# EAGLE design sensorboard (EAGLE 6.5.0)
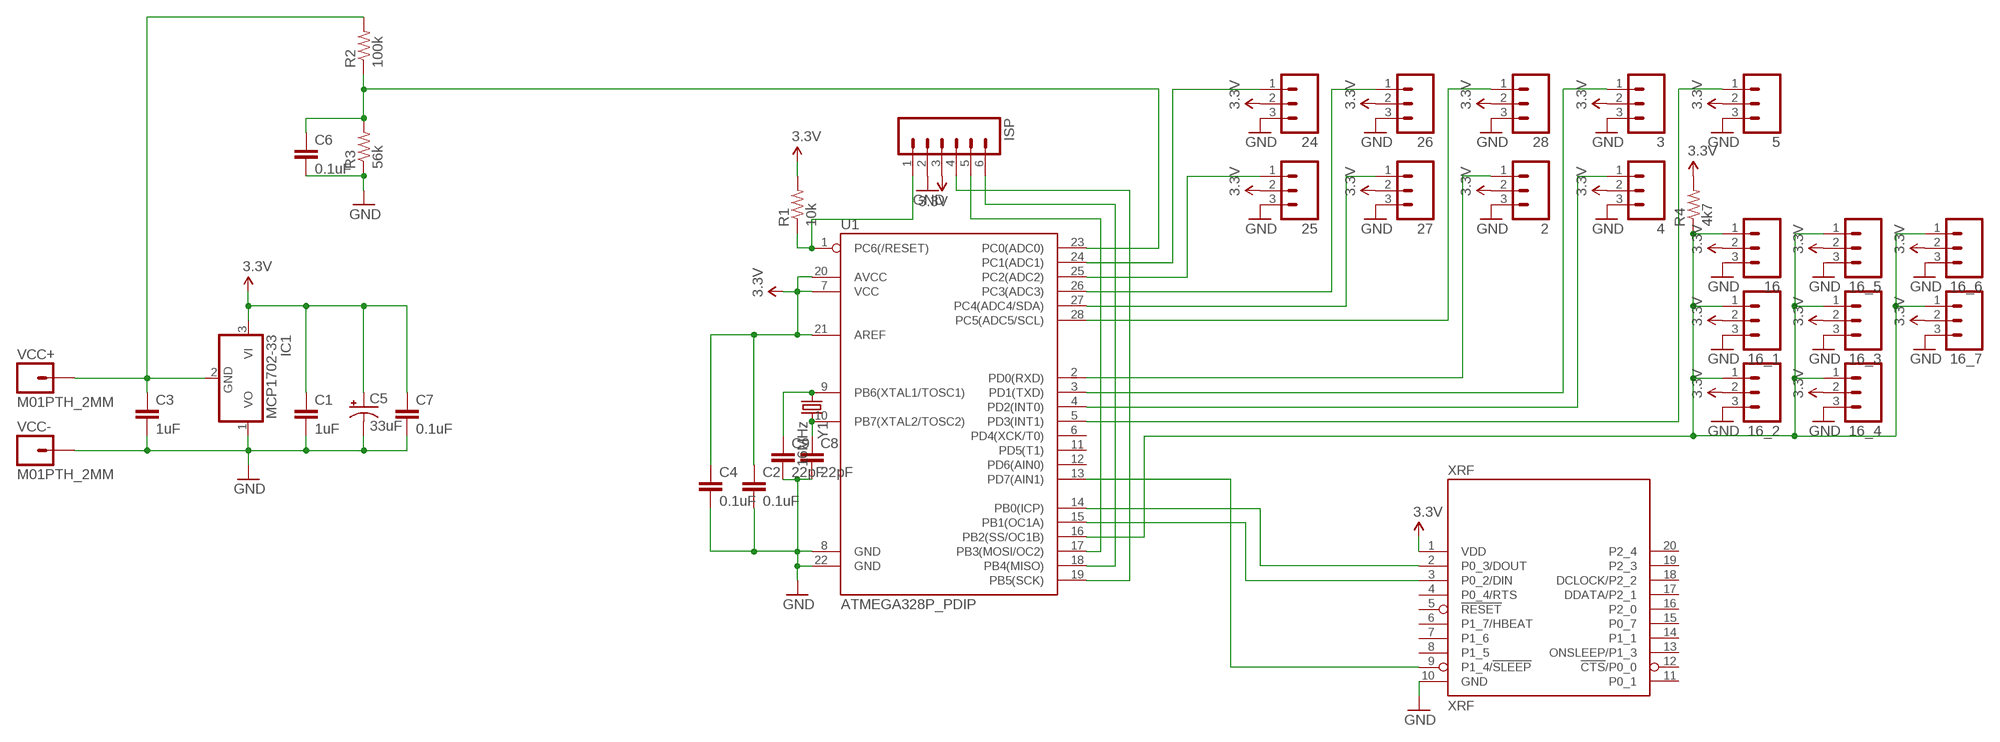
[diagram p0: schematic, sheet 1]

## Parts
2  M031X03_NO_SILK  [1X03_NO_SILK]
3  M031X03_NO_SILK  [1X03_NO_SILK]
4  M031X03_NO_SILK  [1X03_NO_SILK]
5  M031X03_NO_SILK  [1X03_NO_SILK]
16  M031X03_NO_SILK  [1X03_NO_SILK]
16_1  M031X03_NO_SILK  [1X03_NO_SILK]
16_2  M031X03_NO_SILK  [1X03_NO_SILK]
16_3  M031X03_NO_SILK  [1X03_NO_SILK]
16_4  M031X03_NO_SILK  [1X03_NO_SILK]
16_5  M031X03_NO_SILK  [1X03_NO_SILK]
16_6  M031X03_NO_SILK  [1X03_NO_SILK]
16_7  M031X03_NO_SILK  [1X03_NO_SILK]
24  M031X03_NO_SILK  [1X03_NO_SILK]
25  M031X03_NO_SILK  [1X03_NO_SILK]
26  M031X03_NO_SILK  [1X03_NO_SILK]
27  M031X03_NO_SILK  [1X03_NO_SILK]
28  M031X03_NO_SILK  [1X03_NO_SILK]
C1  1uF  CAPEZ  [CAP-PTH-SMALLEZ]
C2  0.1uF  CAPEZ  [CAP-PTH-SMALLEZ]
C3  1uF  CAPEZ  [CAP-PTH-SMALLEZ]
C4  0.1uF  CAPEZ  [CAP-PTH-SMALLEZ]
C5  33uF  CAP_POLPTH2  [CPOL-RADIAL-10UF-25V]
C6  0.1uF  CAPEZ  [CAP-PTH-SMALLEZ]
C7  0.1uF  CAPEZ  [CAP-PTH-SMALLEZ]
C8  22pF  CAPEZ  [CAP-PTH-SMALLEZ]
C9  22pF  CAPEZ  [CAP-PTH-SMALLEZ]
IC1  MCP1702-33  78L05Z  [TO92]
ISP  M06SIP  [1X06]
R1  10k  RESISTOREZ  [AXIAL-0.3EZ]
R2  100k  RESISTOREZ  [AXIAL-0.3EZ]
R3  56k  RESISTOREZ  [AXIAL-0.3EZ]
R4  4k7  RESISTOREZ  [AXIAL-0.3EZ]
U1  ATMEGA328P_PDIP  [DIL28-3]
VCC+  M01PTH_2MM  [1X01_2MM]
VCC-  M01PTH_2MM  [1X01_2MM]
XRF  XRF  XRFXRF  [XRF]
Y1  16MHz  CRYSTALHC49US  [HC49US]

## Nets
3.3V: 2.2 3.2 4.2 5.2 16.2 16_1.2 16_2.2 16_3.2 16_4.2 16_5.2 16_6.2 16_7.2 24.2 25.2 26.2 27.2 28.2 C1.1 C2.1 C4.1 C5.1(+) C7.1 IC1.3(VI) ISP.3 R1.P$2 R4.P$2 U1.7(VCC) U1.20(AVCC) U1.21(AREF) XRF.1(VDD)
GND: 2.3 3.3 4.3 5.3 16.3 16_1.3 16_2.3 16_3.3 16_4.3 16_5.3 16_6.3 16_7.3 24.3 25.3 26.3 27.3 28.3 C1.2 C2.2 C3.2 C4.2 C5.2(-) C6.2 C7.2 C8.2 C9.2 IC1.1(VO) ISP.2 R3.P$1 U1.8(GND) U1.22(GND) VCC-.1 XRF.10(GND)
N$1: ISP.1 R1.P$1 U1.1(PC6(/RESET))
N$2: 28.1 U1.28(PC5(ADC5/SCL))
N$3: ISP.6 U1.18(PB4(MISO))
N$4: ISP.4 U1.19(PB5(SCK))
N$5: ISP.5 U1.17(PB3(MOSI/OC2))
N$6: 2.1 U1.2(PD0(RXD))
N$7: C3.1 IC1.2(GND) R2.P$2 VCC+.1
N$8: 24.1 U1.24(PC1(ADC1))
N$9: U1.15(PB1(OC1A)) XRF.3(P0_2/DIN)
N$10: U1.13(PD7(AIN1)) XRF.9(P1_4/!SLEEP)
N$11: 3.1 U1.3(PD1(TXD))
N$12: 5.1 U1.5(PD3(INT1))
N$13: 4.1 U1.4(PD2(INT0))
N$14: C9.1 U1.9(PB6(XTAL1/TOSC1)) Y1.1
N$15: 16.1 16_1.1 16_2.1 16_3.1 16_4.1 16_5.1 16_6.1 16_7.1 R4.P$1 U1.16(PB2(SS/OC1B))
N$16: C8.1 U1.10(PB7(XTAL2/TOSC2)) Y1.2
N$18: U1.14(PB0(ICP)) XRF.2(P0_3/DOUT)
N$19: 25.1 U1.25(PC2(ADC2))
N$20: C6.1 R2.P$1 R3.P$2 U1.23(PC0(ADC0))
N$21: 26.1 U1.26(PC3(ADC3))
N$22: 27.1 U1.27(PC4(ADC4/SDA))
Unconnected: U1.6(PD4(XCK/T0)) U1.11(PD5(T1)) U1.12(PD6(AIN0)) XRF.4(P0_4/RTS) XRF.5(!RESET) XRF.6(P1_7/HBEAT) XRF.7(P1_6) XRF.8(P1_5) XRF.11(P0_1) XRF.12(!CTS!/P0_0) XRF.13(ONSLEEP/P1_3) XRF.14(P1_1) XRF.15(P0_7) XRF.16(P2_0) XRF.17(DDATA/P2_1) XRF.18(DCLOCK/P2_2) XRF.19(P2_3) XRF.20(P2_4)

## Library data of the parts
2-5 16 16_1-16_7 24-28 = SparkFun-Connectors:M03: Header 3 Standard 3-pin 0.1" header. Use with straight break away headers (SKU : PRT-00116), right angle break away headers (PRT-00553), swiss pins (PRT-00743), machine pins (PRT-00117), and female headers (PRT-00115). Molex polarized connector foot print use with SKU : PRT-08232 with associated crimp pins and housings.
C1-C4 C6-C9 = SparkFun-Capacitors:CAP: Capacitor Standard 0603 ceramic capacitor, and 0.1" leaded capacitor.
C5 = SparkFun-Capacitors:CAP_POL: Capacitor Polarized These are standard SMD and PTH capacitors. Normally 10uF, 47uF, and 100uF in electrolytic and tantalum varieties. Always verify the external diameter of the through hole cap, it varies with capacity, voltage, and manufacturer. The EIA devices should be standard.
IC1 = linear:78*: Positive VOLTAGE REGULATOR Source: http://cache.national.com/ds/LM/LM78L05.pdf http://www.fairchildsemi.com/ds/LM/LM7805.pdf
ISP = SparkFun-Connectors:M06: Header 6 Standard 6-pin 0.1" header. Use with straight break away headers (SKU : PRT-00116), right angle break away headers (PRT-00553), swiss pins (PRT-00743), machine pins (PRT-00117), and female headers (PRT-00115). Molex polarized connector foot print use with SKU : PRT-08094 with associated crimp pins and housings. NOTES ON THE VARIANTS LOCK and LOCK_LONGPADS... This footprint was designed to help hold the alignment of a through-hole component (i.e. 6-pin header) while soldering it into place. You may notice that each hole has been shifted either up or down by 0.005 of an inch from it's more standard position (which is a perfectly straight line). This slight alteration caused the pins (the squares in the middle) to touch the edges of the holes. Because they are alternating, it causes a "brace" to hold the component in place. 0.005 has proven to be the perfect amount of "off-center" position when using our standard breakaway headers. Although looks a little odd when you look at the bare footprint, once you have a header in there, the alteration is very hard to notice. Also, if you push a header all the way into place, it is covered up entirely on the bottom side. This idea of altering the position of holes to aid alignment will be further integrated into the Sparkfun Library for other footprints. It can help hold any component with 3 or more connection pins.
R1-R4 = SparkFun-Resistors:RESISTOR: Resistor Basic schematic elements and footprints for 0603, 1206, and PTH resistors.
U1 = SparkFun-DigitalIC:ATMEGA328P_PDIP: uC used in the Arduino 32kb flash, 1k EEPROM, 2k SRAM This is the through-hole version of this chip.
VCC+ VCC- = SparkFun-Connectors:M01: Header 1 Standard 1-pin 0.1" header. Use with straight break away headers (SKU : PRT-00116), right angle break away headers (PRT-00553), swiss pins (PRT-00743), machine pins (PRT-00117), and female headers (PRT-00115).
XRF = Ciseco+Footprints:XRF: XRF Wireless UART Serial Data Module. www.ciseco.co.uk
Y1 = SparkFun-FreqCtrl:CRYSTAL: Various standard crystals. Proven footprints. Spark Fun Electronics SKU : COM-00534

## Board
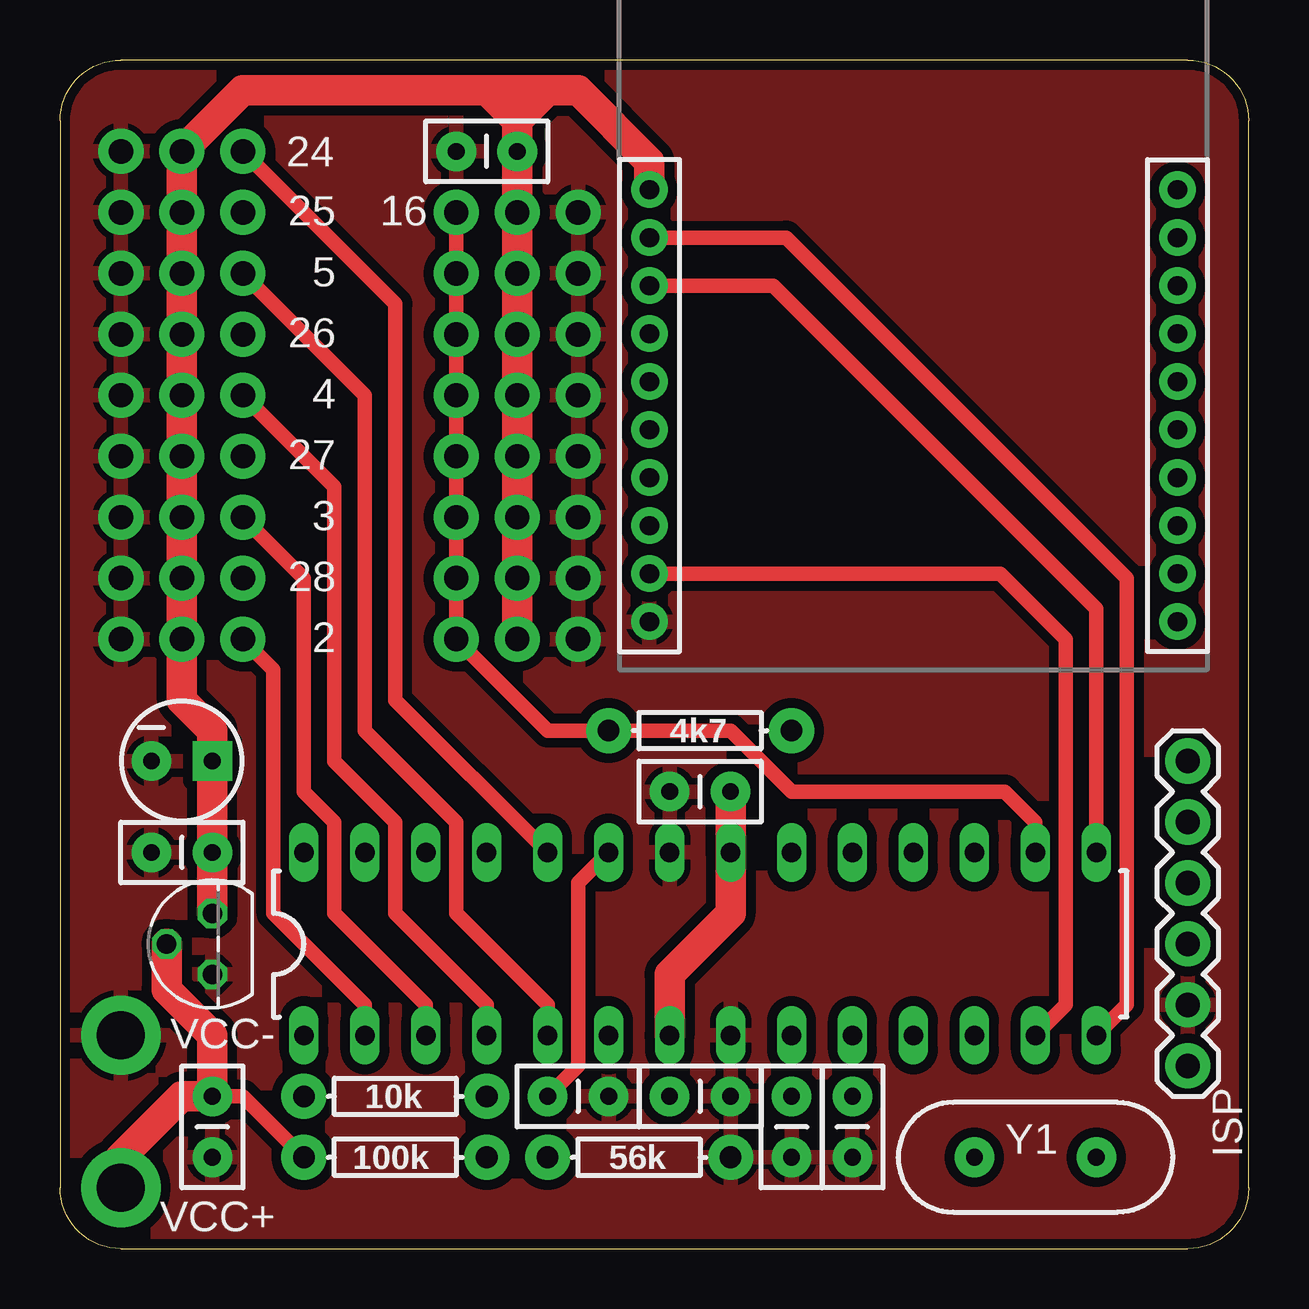
[diagram p1: board, top side]
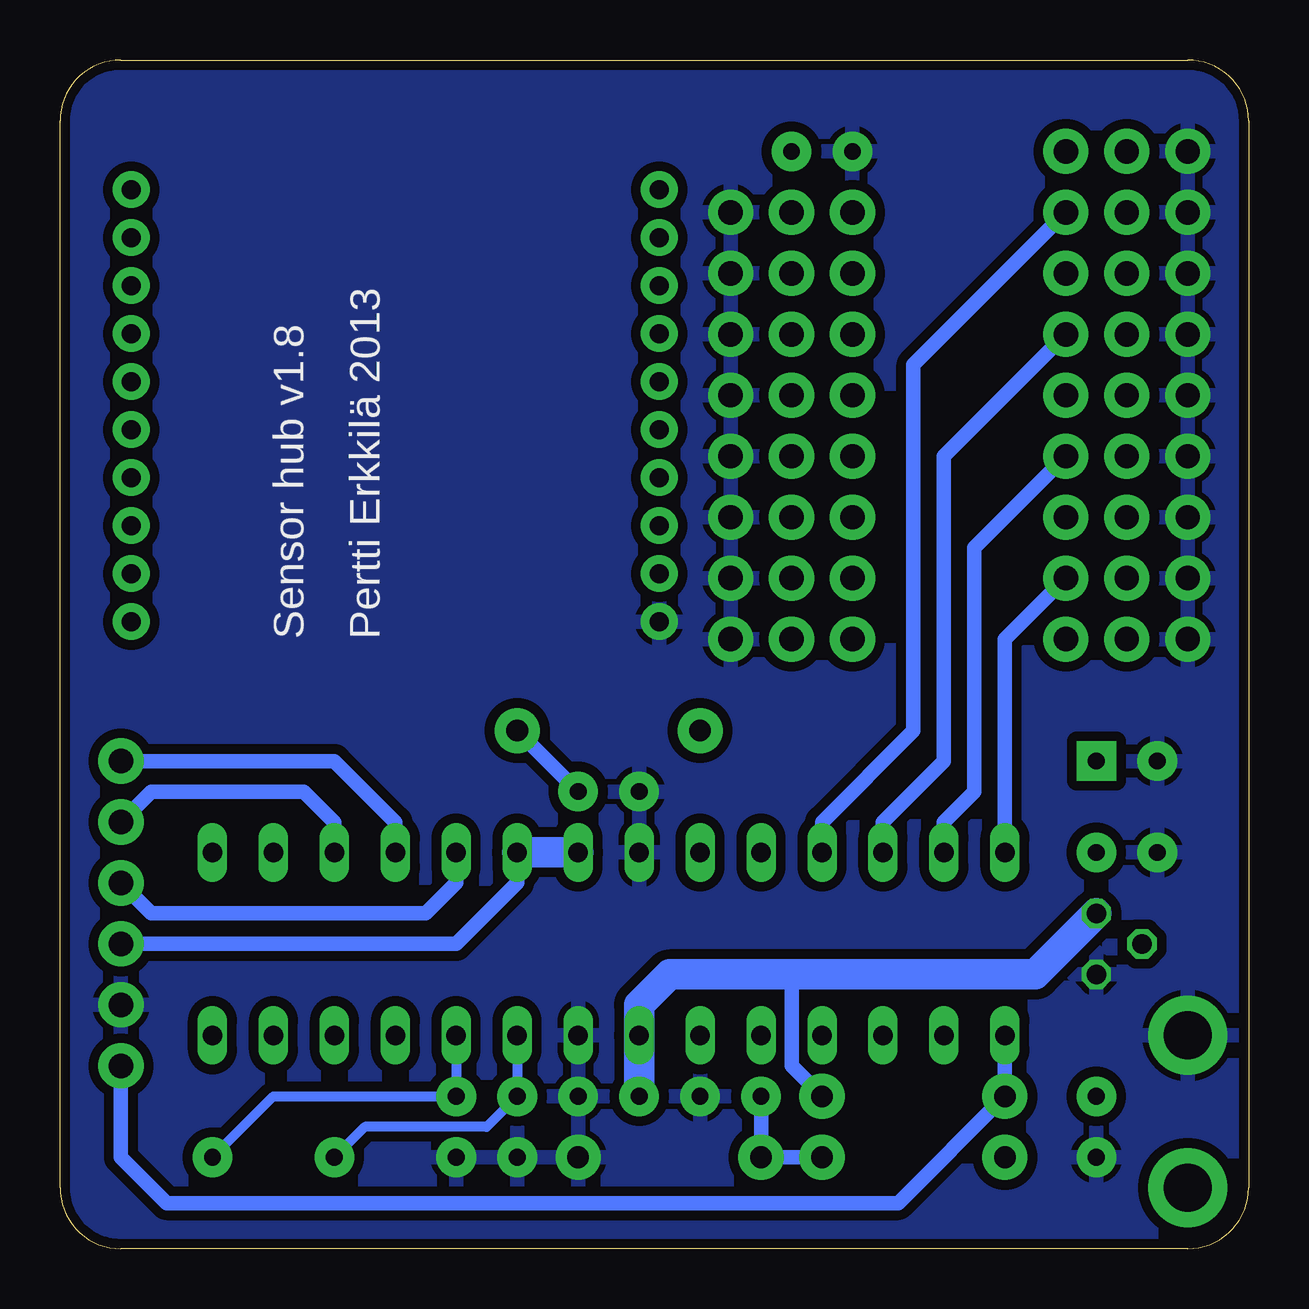
[diagram p2: board, bottom side, seen from below]

Size 49.53 x 49.53 mm. Coordinates in mm from the lower left corner, seen from the top.
Outline: 2.54,0 46.99,0 arc90 49.53,2.54 49.53,46.99 arc90 46.99,49.53 2.54,49.53 arc90 0,46.99 0,2.54 arc90 2.54,0
Copper layers (1*16): Top 0.0356mm / dielectric 1.5011mm / Bottom 0.0356mm
Design rules "LaenPCBOrder": minimum track width 6mil, minimum drill 13mil, track to track 6mil, track to pad 6mil, pad to pad 6mil, via to via 6mil, smd to smd 6mil, copper to edge 15mil, drill to drill 6mil, minimum pad ring 7mil, minimum via ring 7mil, stop-mask expansion 4mil, vias tented up to drill 0mil, thermal gap 10mil

### Footprints (pad centres in the part's own frame; a part is rotated, then mirrored left to right if it is on the bottom)
1X03_NO_SILK = drill 1.016 pad 1.88: 1 0,0; 2 2.54,0; 3 5.08,0
CAP-PTH-SMALLEZ = drill 0.7 pad 1.651: 1 0,0; 2 2.54,0
CPOL-RADIAL-10UF-25V = drill 0.7 pad 1.651 square: 1 1.27,0 | drill 0.7 pad 1.651: 2 -1.27,0
TO92 = drill 0.813 octagon: 1 -1.27,0; 2 0,1.905; 3 1.27,0
1X06 = drill 1.016 pad 1.88: 1 0,0; 2 2.54,0; 3 5.08,0; 4 7.62,0; 5 10.16,0; 6 12.7,0
AXIAL-0.3EZ = drill 0.9 pad 1.88: P$1 -3.81,0; P$2 3.81,0
DIL28-3 = drill 0.813 long: 1 -16.51,-3.81; 2 -13.97,-3.81; 3 -11.43,-3.81; 4 -8.89,-3.81; 5 -6.35,-3.81; 6 -3.81,-3.81; 7 -1.27,-3.81; 8 1.27,-3.81; 9 3.81,-3.81; 10 6.35,-3.81; 11 8.89,-3.81; 12 11.43,-3.81; 13 13.97,-3.81; 14 16.51,-3.81; 15 16.51,3.81; 16 13.97,3.81; 17 11.43,3.81; 18 8.89,3.81; 19 6.35,3.81; 20 3.81,3.81; 21 1.27,3.81; 22 -1.27,3.81; 23 -3.81,3.81; 24 -6.35,3.81; 25 -8.89,3.81; 26 -11.43,3.81; 27 -13.97,3.81; 28 -16.51,3.81
1X01_2MM = drill 2 pad 3.302: 1 0,0
XRF = drill 0.8 pad 1.524: 1 -11,20; 2 -11,18; 3 -11,16; 4 -11,14; 5 -11,12; 6 -11,10; 7 -11,8; 8 -11,6; 9 -11,4; 10 -11,2; 11 11,2; 12 11,4; 13 11,6; 14 11,8; 15 11,10; 16 11,12; 17 11,14; 18 11,16; 19 11,18; 20 11,20
HC49US = drill 0.7 pad 1.651: 1 -2.54,0; 2 2.54,0

### Placement (x,y rotation side)
2  7.62,25.4 180 top
3  7.62,30.48 180 top
4  7.62,35.56 180 top
5  7.62,40.64 180 top
16  16.51,43.18 0 top
16_1  16.51,40.64 0 top
16_2  16.51,38.1 0 top
16_3  16.51,35.56 0 top
16_4  16.51,33.02 0 top
16_5  16.51,30.48 0 top
16_6  16.51,27.94 0 top
16_7  16.51,25.4 0 top
24  7.62,45.72 180 top
25  7.62,43.18 180 top
26  7.62,38.1 180 top
27  7.62,33.02 180 top
28  7.62,27.94 180 top
C1  6.35,16.51 180 top
C2  25.4,6.35 0 top
C3  6.35,6.35 270 top
C4  27.94,19.05 180 top
C5  5.08,20.32 0 top
C6  20.32,6.35 0 top
C7  19.05,45.72 180 top
C8  33.02,6.35 270 top
C9  30.48,6.35 270 top
IC1  6.35,12.7 90 top
ISP  46.99,7.62 90 top
R1  13.97,6.35 0 top
R2  13.97,3.81 180 top
R3  24.13,3.81 180 top
R4  26.67,21.59 0 top
U1  26.67,12.7 0 top
VCC+  2.54,2.54 0 top
VCC-  2.54,8.89 0 top
XRF  35.56,24.13 0 top
Y1  40.64,3.81 0 top

### Tracks (layer width: path | path; a pad name or v marks a point on that pad's centre or on a via)
3.3V
  Top 1.27: C4.1 U1.21 27.94,13.97 25.4,11.43 U1.7 | 17.78,48.26 7.62,48.26 24.2 25.2 5.2 26.2 4.2 27.2 3.2 28.2 2.2 5.08,22.86 6.35,21.59 C5.1 C1.1 IC1.3 | 17.78,48.26 19.05,48.26 | 19.05,48.26 19.05,46.99 | 19.05,46.99 C7.1 16.2 16_1.2 16_2.2 16_3.2 16_4.2 16_5.2 16_6.2 16_7.2 | 19.05,48.26 20.32,48.26 | 20.32,48.26 21.59,48.26 24.56,45.29 XRF.1 | 17.78,48.26 19.05,46.99 | 20.32,48.26 19.05,46.99
  Bottom 0.61: R1.P$2 19.05,7.62 19.05,11.43 | U1.20 30.48,15.24 33.02,12.7 ISP.3 | C4.1 R4.P$2
  Bottom 1.27: U1.21 U1.20 | C2.1 U1.7 25.4,10.16 24.13,11.43 19.05,11.43 8.89,11.43 IC1.3
GND
  pour Bottom (isolate 0.406): -1.27,50.8 50.8,50.8 50.8,-1.27 -1.27,-1.27
  pour Top (isolate 0.406): -2.54,52.07 52.07,52.07 52.07,-2.54 -2.54,-2.54
N$1
  Bottom 0.61: U1.1 R1.P$1 14.61,1.91 45.09,1.91 46.99,3.81 ISP.1
N$2
  Bottom 0.61: U1.28 10.16,25.4 28.1
N$3
  Bottom 0.61: U1.18 35.56,17.78 38.1,20.32 ISP.6
N$4
  Bottom 0.61: U1.19 33.02,15.24 34.29,13.97 45.72,13.97 ISP.4
N$5
  Bottom 0.61: ISP.5 45.72,19.05 44.45,19.05 39.37,19.05 38.1,17.78 U1.17
N$6
  Top 0.61: U1.2 12.7,10.16 8.89,13.97 8.89,24.13 2.1
N$7
  Top 0.61: C3.1 7.62,6.35 R2.P$2
  Top 1.27: VCC+.1 2.54,3.81 5.08,6.35 C3.1 6.35,8.89 4.45,10.79 IC1.2
N$8
  Top 0.61: U1.24 13.97,22.86 13.97,39.37 24.1
N$9
  Top 0.61: XRF.3 29.72,40.13 43.18,26.67 U1.15
N$10
  Top 0.61: XRF.9 39.18,28.13 41.91,25.4 41.91,10.16 U1.13
N$11
  Top 0.61: U1.3 15.24,10.16 11.43,13.97 11.43,17.78 10.16,19.05 10.16,27.94 3.1
N$12
  Top 0.61: U1.5 20.32,10.16 16.51,13.97 16.51,17.78 12.7,21.59 12.7,35.56 5.1
N$13
  Top 0.61: U1.4 17.78,10.16 13.97,13.97 13.97,17.78 11.43,20.32 11.43,31.75 4.1
N$14
  Bottom 0.406: U1.9 C9.1 31.75,5.08 36.83,5.08 Y1.1
N$15
  Top 0.61: 16.1 16_1.1 16_2.1 16_3.1 16_4.1 16_5.1 16_6.1 16_7.1 20.32,21.59 R4.P$1 27.94,21.59 30.48,19.05 39.37,19.05 40.64,17.78 U1.16
N$16
  Bottom 0.406: U1.10 C8.1 40.64,6.35 Y1.2
N$18
  Top 0.61: XRF.2 30.26,42.13 44.45,27.94 44.45,10.16 U1.14
N$19
  Bottom 0.61: U1.25 17.78,17.78 13.97,21.59 13.97,36.83 25.1
N$20
  Top 0.61: U1.23 21.59,15.24 21.59,7.62 C6.1
  Bottom 0.61: R2.P$1 R3.P$2 C6.1
N$21
  Bottom 0.61: U1.26 15.24,17.78 12.7,20.32 12.7,33.02 26.1
N$22
  Bottom 0.61: U1.27 12.7,17.78 11.43,19.05 11.43,29.21 27.1

### Text on the board
bPlace: Pertti Erkkilä 2013 | Sensor hub v1.8